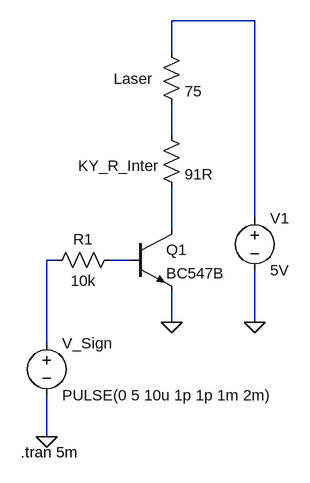
[diagram p0: schematic ltspace-buffer-ky-008.asc]
ltspace-buffer-ky-008.asc, the LTspice schematic file:
Version 4.1
SHEET 1 880 680
WIRE 608 -16 480 -16
WIRE 480 32 480 -16
WIRE 480 160 480 112
WIRE 608 288 608 -16
WIRE 480 304 480 240
WIRE 304 352 288 352
WIRE 416 352 384 352
WIRE 480 448 480 400
WIRE 608 448 608 368
WIRE 288 480 288 352
WIRE 288 624 288 560
FLAG 480 448 0
FLAG 608 448 0
FLAG 288 624 0
SYMBOL npn 416 304 R0
SYMATTR InstName Q1
SYMATTR Value BC547B
SYMBOL voltage 608 272 R0
WINDOW 123 0 0 Left 0
WINDOW 39 0 0 Left 0
SYMATTR InstName V1
SYMATTR Value 5V
SYMBOL voltage 288 464 R0
WINDOW 123 0 0 Left 0
WINDOW 39 0 0 Left 0
SYMATTR InstName V_Sign
SYMATTR Value PULSE(0 5 10u 1p 1p 1m 2m)
SYMBOL res 288 368 R270
WINDOW 0 32 56 VTop 2
WINDOW 3 0 56 VBottom 2
SYMATTR InstName R1
SYMATTR Value 10k
SYMBOL res 464 144 R0
WINDOW 0 -128 63 Left 2
SYMATTR InstName KY_R_Inter
SYMATTR Value 91R
SYMBOL res 464 16 R0
WINDOW 0 -73 57 Left 2
SYMATTR InstName Laser
SYMATTR Value 75
TEXT 248 648 Left 2 !.tran 5m

The netlist it stands for:
* ltspace-buffer-ky-008.asc
Q1 N003 N005 0 0 BC547B
V1 N001 0 5V
V_Sign N004 0 PULSE(0 5 10u 1p 1p 1m 2m)
R1 N004 N005 10k
R§KY_R_Inter N002 N003 91R
R§Laser N001 N002 75
.model NPN NPN
.model PNP PNP
.lib standard.bjt
.tran 5m
.backanno
.end